# Altium schematic sheet Sensores.SchDoc
size A3
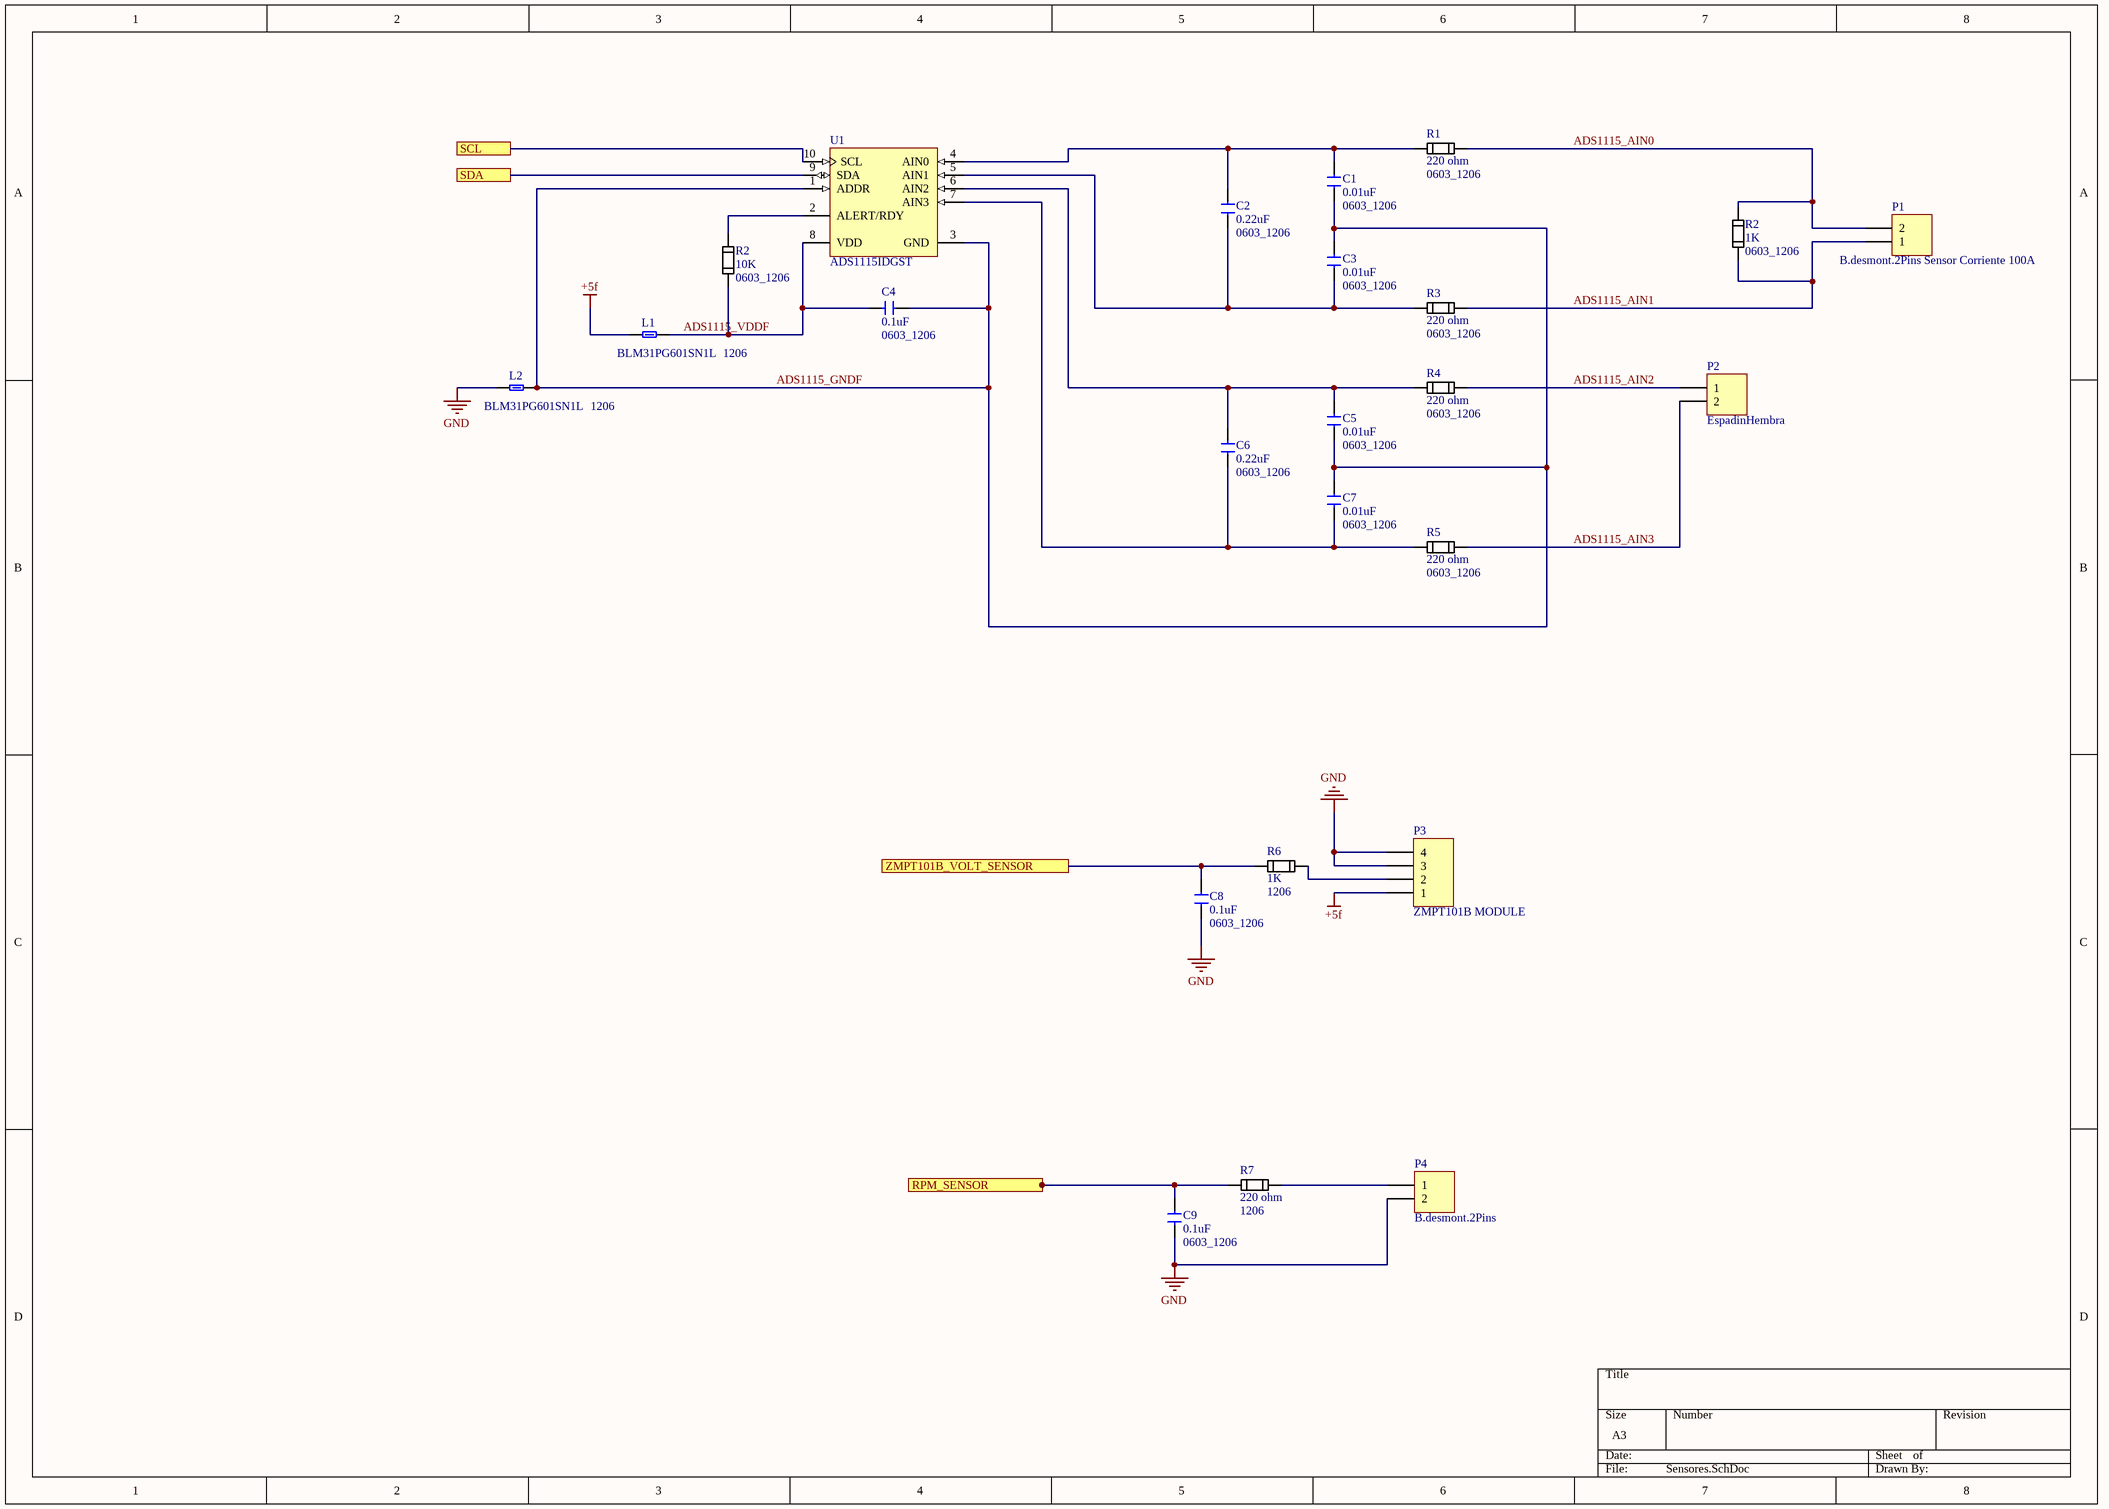
[diagram p0: Sensores.SchDoc]

## Parts
(Parts that share a designator on the sheet are numbered #1, #2 ... from top to bottom, then left to right.)
C1  0.01uF  value 0603_1206  [SMD_CHIP_CAP_CER_0603_TO_1206]
C2  0.22uF  value 0603_1206  [SMD_CHIP_CAP_CER_0603_TO_1206]
C3  0.01uF  value 0603_1206  [SMD_CHIP_CAP_CER_0603_TO_1206]
C4  0.1uF  value 0603_1206  [SMD_CHIP_CAP_CER_0603_TO_1206]
C5  0.01uF  value 0603_1206  [SMD_CHIP_CAP_CER_0603_TO_1206]
C6  0.22uF  value 0603_1206  [SMD_CHIP_CAP_CER_0603_TO_1206]
C7  0.01uF  value 0603_1206  [SMD_CHIP_CAP_CER_0603_TO_1206]
C8  0.1uF  value 0603_1206  [SMD_CHIP_CAP_CER_0603_TO_1206]
C9  0.1uF  value 0603_1206  [SMD_CHIP_CAP_CER_0603_TO_1206]
L1  BLM31PG601SN1L  value 1206  [SMD_CHIP_FERRITE_1206]
L2  BLM31PG601SN1L  value 1206  [SMD_CHIP_FERRITE_1206]
P1  B.desmont.2Pins Sensor Corriente 100A  [KF2EDGV/R-2P]
P2  EspadinHembra  [HDR1X2]
P3  ZMPT101B MODULE  [ZMPT101B_MODULE]
P4  B.desmont.2Pins  [KF2EDGV/R-2P]
R1  220 ohm  value 0603_1206  [SMD_CHIP_RESISTOR_0603_TO_1206]
R2#1  1K  value 0603_1206  [SMD_CHIP_RESISTOR_0603_TO_1206]
R2#2  10K  value 0603_1206  [SMD_CHIP_RESISTOR_0603_TO_1206]
R3  220 ohm  value 0603_1206  [SMD_CHIP_RESISTOR_0603_TO_1206]
R4  220 ohm  value 0603_1206  [SMD_CHIP_RESISTOR_0603_TO_1206]
R5  220 ohm  value 0603_1206  [SMD_CHIP_RESISTOR_0603_TO_1206]
R6  1K  value 1206  [SMD_CHIP_RESISTOR_1206]
R7  220 ohm  value 1206  [SMD_CHIP_RESISTOR_1206]
U1  ADS1115IDGST  [TI-DGS10_L]

## Ports
RPM_SENSOR, SCL, SDA, ZMPT101B_VOLT_SENSOR

## Nets
+5f: L1.1 P3.1
GND: C8.1 C9.1 L2.1 P3.3 P3.4 P4.2
ADS1115_AIN0: P1.2 R1.2 R2#1.2
ADS1115_AIN1: P1.1 R2#1.1 R3.2
ADS1115_AIN2: P2.1 R4.2
ADS1115_AIN3: P2.2 R5.2
ADS1115_GNDF: C1.1 C3.2 C4.1 C5.1 C7.2 L2.2 U1.1(ADDR) U1.3(GND)
ADS1115_VDDF: C4.2 L1.2 R2#2.1 U1.8(VDD)
RPM_SENSOR: C9.2 R7.1 ; port RPM_SENSOR
SCL: U1.10(SCL) ; port SCL
SDA: U1.9(SDA) ; port SDA
ZMPT101B_VOLT_SENSOR: C8.2 R6.1 ; port ZMPT101B_VOLT_SENSOR
NetC1_2: C1.2 C2.2 R1.1 U1.4(AIN0)
NetC2_1: C2.1 C3.1 R3.1 U1.5(AIN1)
NetC5_2: C5.2 C6.2 R4.1 U1.6(AIN2)
NetC6_1: C6.1 C7.1 R5.1 U1.7(AIN3)
NetP3_2: P3.2 R6.2
NetP4_1: P4.1 R7.2
NetR2#2_2: R2#2.2 U1.2(ALERT/RDY)

## Library data of the parts
C1-C9 = SMD_CHIP_CAP_CER_0603_TO_1206
L1 L2 = CHIP_FERRITE_BEAD_INDUCTOR_1206: Chip Ferrite Bead Inductor
P1 P2 P4 = Header 2: Header, 2-Pin; LatestRevisionDate: 17-Jul-2002; LatestRevisionNote: Re-released for DXP Platform.; Publisher: Altium Limited
P3 = Header 4: Header, 4-Pin; LatestRevisionDate: 17-Jul-2002; LatestRevisionNote: Re-released for DXP Platform.; Publisher: Altium Limited
R1 R2#1 R2#2 R3-R5 = SMD_CHIP_RESISTOR_0603_TO_1206
R6 R7 = SMD_CHIP_RESISTOR_1206
U1 = CMP-0003-00378-2: 16-Bit ADC with Integrated Multiplexer, PGA, Comparator, Oscillator, and Reference, -40 to 125 degC, 10-pin SOP (DGS10), Green (RoHS & no Sb/Br); Manufacturer: Texas Instruments; Sample Rate (max)(SPS): 860; SubFamily: Precision ADC (<=10MSPS); Architecture: Delta-Sigma; Digital Supply(Min)(V): 2; Resolution(Bits): 16; Digital Supply(Max)(V): 5.5; INL(Max)(+/-LSB): 1; Interface: Serial I2C; # Input Channels: 4; Eco-Plan: Green (RoHS & no Sb/Br); PackageDescription: 10-Pin Plastic Small Outline, Body 3 x 3 mm, Pitch 0.5 mm; Mounting Technology: Surface Mount; PackageReference: DGS10; DatasheetVersion: SBAS444B; ComponentLink3Description: Package Specification; ComponentLink1Description: Manufacturer URL; PartNumber: ADS1115IDGST; ComponentLink3URL: http://www.ti.com/lit/ml/mpds035b/mpds035b.pdf; ComponentLink2URL: http://www.ti.com/general/docs/lit/getliterature.tsp?genericPartNumber=ADS1115&fileType=pdf; Analog Voltage AV/DD(Min)(V): 2; ComponentLink2Description: Datasheet; PackageVersion: 4073272/C, 02/2004; Analog Voltage AV/DD(Max)(V): 5.5; Code_JEDEC: MO-153; ComponentLink1URL: http://www.ti.com/